# EAGLE design JW24A10L_revA (EAGLE 6.1)
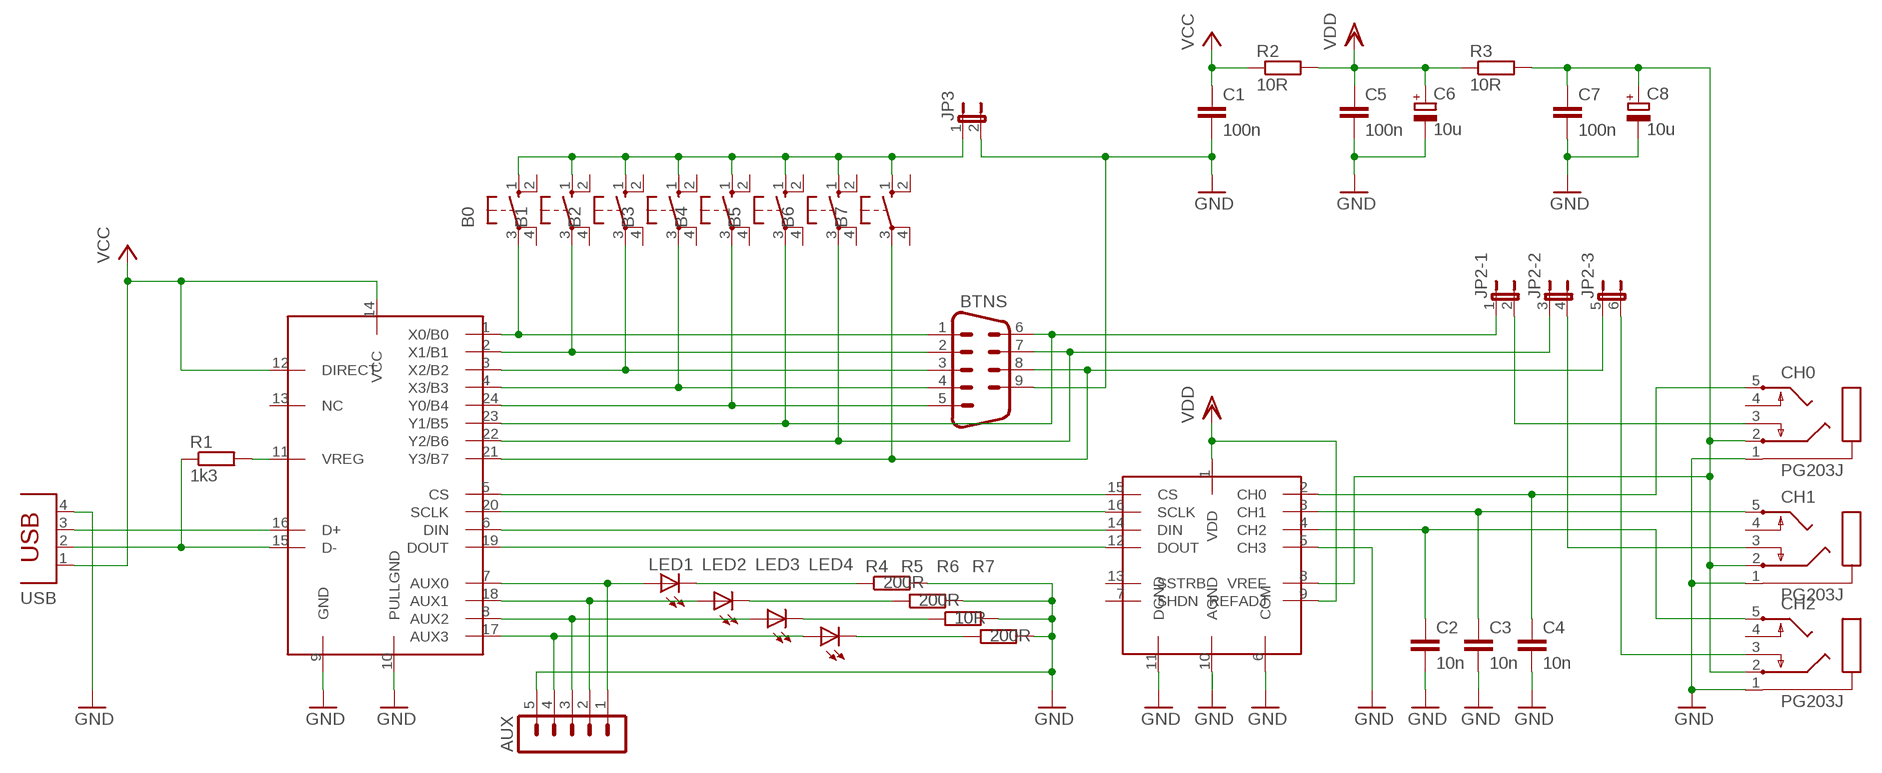
[diagram p0: schematic, sheet 1]

## Parts
AUX  MA05-1  [MA05-1]
B0  10-XX  [B3F-10XX]
B1  10-XX  [B3F-10XX]
B2  10-XX  [B3F-10XX]
B3  10-XX  [B3F-10XX]
B4  10-XX  [B3F-10XX]
B5  10-XX  [B3F-10XX]
B6  10-XX  [B3F-10XX]
B7  10-XX  [B3F-10XX]
BTNS  M09HP  [M09HP]
C1  100n  C-EU025-025X050  [C025-025X050]
C2  10n  C-EU025-025X050  [C025-025X050]
C3  10n  C-EU025-025X050  [C025-025X050]
C4  10n  C-EU025-025X050  [C025-025X050]
C5  100n  C-EU025-025X050  [C025-025X050]
C6  10u  CPOL-EUE2-5  [E2-5]
C7  100n  C-EU025-025X050  [C025-025X050]
C8  10u  CPOL-EUE2-5  [E2-5]
CH0  PG203J  [PG203J]
CH1  PG203J  [PG203J]
CH2  PG203J  [PG203J]
JP2  JP3QE  [JP3Q]
JP3  JP1E  [JP1]
LED1  LED3MM  [LED3MM]
LED2  LED3MM  [LED3MM]
LED3  LED3MM  [LED3MM]
LED4  LED3MM  [LED3MM]
R1  1k3  R-EU_0204/7  [0204/7]
R2  10R  R-EU_0204/7  [0204/7]
R3  10R  R-EU_0204/7  [0204/7]
R4  200R  R-EU_0204/7  [0204/7]
R5  200R  R-EU_0204/7  [0204/7]
R6  10R  R-EU_0204/7  [0204/7]
R7  200R  R-EU_0204/7  [0204/7]
U$1  MAX1249  [DIL16]
U$2  JW24A10L  [DIL24-3]
USB  PN61729  [PN61729]

## Nets
AUX0: AUX.1 LED1.A U$2.7(AUX0)
AUX1: AUX.2 LED2.A U$2.18(AUX1)
AUX2: AUX.3 LED3.A U$2.8(AUX2)
AUX3: AUX.4 LED4.A U$2.17(AUX3)
CH1: C4.1 CH0.5 U$1.2(CH0)
CH2: CH2.3 JP2.6
GND: AUX.5 BTNS.9 C1.2 C2.2 C3.2 C4.2 C5.2 C6.- C7.2 C8.- CH0.1 CH1.1 CH2.1 JP3.2 R4.2 R5.2 R6.2 R7.2 U$1.5(CH3) U$1.6(COM) U$1.10(AGND) U$1.11(DGND) U$2.9(GND) U$2.10(PULLGND) USB.4
N$1: U$1.15(CS) U$2.5(CS)
N$2: U$1.16(SCLK) U$2.20(SCLK)
N$3: U$1.14(DIN) U$2.6(DIN)
N$4: U$1.12(DOUT) U$2.19(DOUT)
N$5: U$2.16(D+) USB.3
N$6: R1.1 U$2.15(D-) USB.2
N$7: B0.3(P) BTNS.1 U$2.1(X0/B0)
N$9: R1.2 U$2.11(VREG)
N$10: C3.1 CH1.5 U$1.3(CH1)
N$11: C2.1 CH2.5 U$1.4(CH2)
N$12: B1.3(P) BTNS.2 U$2.2(X1/B1)
N$13: B2.3(P) BTNS.3 U$2.3(X2/B2)
N$14: B3.3(P) BTNS.4 U$2.4(X3/B3)
N$15: B4.3(P) BTNS.5 U$2.24(Y0/B4)
N$16: B5.3(P) BTNS.6 JP2.1 U$2.23(Y1/B5)
N$17: B6.3(P) BTNS.7 JP2.3 U$2.22(Y2/B6)
N$18: B7.3(P) BTNS.8 JP2.5 U$2.21(Y3/B7)
N$21: CH1.3 JP2.4
N$22: CH0.3 JP2.2
N$24: C7.1 C8.+ CH0.2 CH1.2 CH2.2 R3.2 U$1.8(VREF)
N$25: LED1.K(C) R4.1
N$26: LED2.K(C) R5.1
N$27: LED3.K(C) R6.1
N$28: LED4.K(C) R7.1
N$30: B0.1(S) B1.1(S) B2.1(S) B3.1(S) B4.1(S) B5.1(S) B6.1(S) B7.1(S) JP3.1
VCC: C1.1 R2.1 U$2.12(DIRECT) U$2.14(VCC) USB.1
VDD: C5.1 C6.+ R2.2 R3.1 U$1.1(VDD) U$1.9(REFADJ)
Unconnected: B0.2(S1) B0.4(P1) B1.2(S1) B1.4(P1) B2.2(S1) B2.4(P1) B3.2(S1) B3.4(P1) B4.2(S1) B4.4(P1) B5.2(S1) B5.4(P1) B6.2(S1) B6.4(P1) B7.2(S1) B7.4(P1) CH0.4 CH1.4 CH2.4 U$1.7(SHDN) U$1.13(SSTRB) U$2.13(NC)

## Library data of the parts
AUX = con-lstb:MA05-1: PIN HEADER; OC_FARNELL: unknown; OC_NEWARK: unknown
B0 B1-B7 = switch-omron:10-XX: OMRON SWITCH; MPN: B3F-1000; OC_FARNELL: 176432; OC_NEWARK: 36M3542
BTNS = con-subd:M09: SUB-D; OC_FARNELL: unknown; OC_NEWARK: unknown
C1-C5 C7 = rcl:C-EU: CAPACITOR, European symbol
C6 C8 = rcl:CPOL-EU: POLARIZED CAPACITOR, European symbol
CH0 CH1 CH2 = con-hirschmann:PG203J: MIC/HEADPHONE JACK KS-S stereo microphone/headphone jack PG203JN (Schukat); OC_FARNELL: unknown; OC_NEWARK: unknown
JP2 = jumper:JP3QE: JUMPER
JP3 = jumper:JP1E: JUMPER
LED1-LED4 = led:LED: LED OSRAM: - CHIPLED LG R971, LG N971, LY N971, LG Q971, LY Q971, LO R971, LY R971 LH N974, LH R974 LS Q976, LO Q976, LY Q976 LO Q996 - Hyper CHIPLED LW Q18S LB Q993, LB Q99A, LB R99A - SideLED LS A670, LO A670, LY A670, LG A670, LP A670 LB A673, LV A673, LT A673, LW A673 LH A674 LY A675 LS A676, LA A676, LO A676, LY A676, LW A676 LS A679, LY A679, LG A679 - Hyper Micro SIDELED® LS Y876, LA Y876, LO Y876, LY Y876 LT Y87S - SmartLED LW L88C, LW L88S LB L89C, LB L89S, LG L890 LS L89K, LO L89K, LY L89K LS L896, LA L896, LO L896, LY L896 - TOPLED LS T670, LO T670, LY T670, LG T670, LP T670 LSG T670, LSP T670, LSY T670, LOP T670, LYG T670 LG T671, LOG T671, LSG T671 LB T673, LV T673, LT T673, LW T673 LH T674 LS T676, LA T676, LO T676, LY T676, LB T676, LH T676, LSB T676, LW T676 LB T67C, LV T67C, LT T67C, LS T67K, LO T67K, LY T67K, LW E67C LS E67B, LA E67B, LO E67B, LY E67B, LB E67C, LV E67C, LT E67C LW T67C LS T679, LY T679, LG T679 LS T770, LO T770, LY T770, LG T770, LP T770 LB T773, LV T773, LT T773, LW T773 LH T774 LS E675, LA E675, LY E675, LS T675 LS T776, LA T776, LO T776, LY T776, LB T776 LHGB T686 LT T68C, LB T68C - Hyper Mini TOPLED® LB M676 - Mini TOPLED Santana® LG M470 LS M47K, LO M47K, LY M47K Source: http://www.osram.convergy.de LUXEON: - LUMILED® LXK2-PW12-R00, LXK2-PW12-S00, LXK2-PW14-U00, LXK2-PW14-V00 LXK2-PM12-R00, LXK2-PM12-S00, LXK2-PM14-U00 LXK2-PE12-Q00, LXK2-PE12-R00, LXK2-PE12-S00, LXK2-PE14-T00, LXK2-PE14-U00 LXK2-PB12-K00, LXK2-PB12-L00, LXK2-PB12-M00, LXK2-PB14-N00, LXK2-PB14-P00, LXK2-PB14-Q00 LXK2-PR12-L00, LXK2-PR12-M00, LXK2-PR14-Q00, LXK2-PR14-R00 LXK2-PD12-Q00, LXK2-PD12-R00, LXK2-PD12-S00 LXK2-PH12-R00, LXK2-PH12-S00 LXK2-PL12-P00, LXK2-PL12-Q00, LXK2-PL12-R00 Source: www.luxeon.com KINGBRIGHT: KA-3528ASYC Source: www.kingbright.com
R1-R7 = rcl:R-EU_: RESISTOR, European symbol
U$1 = eigene:MAX1249
U$2 = eigene:JW24A10L
USB = con-berg:PN61729: BERG USB connector; OC_FARNELL: unknown; OC_NEWARK: unknown

## Board
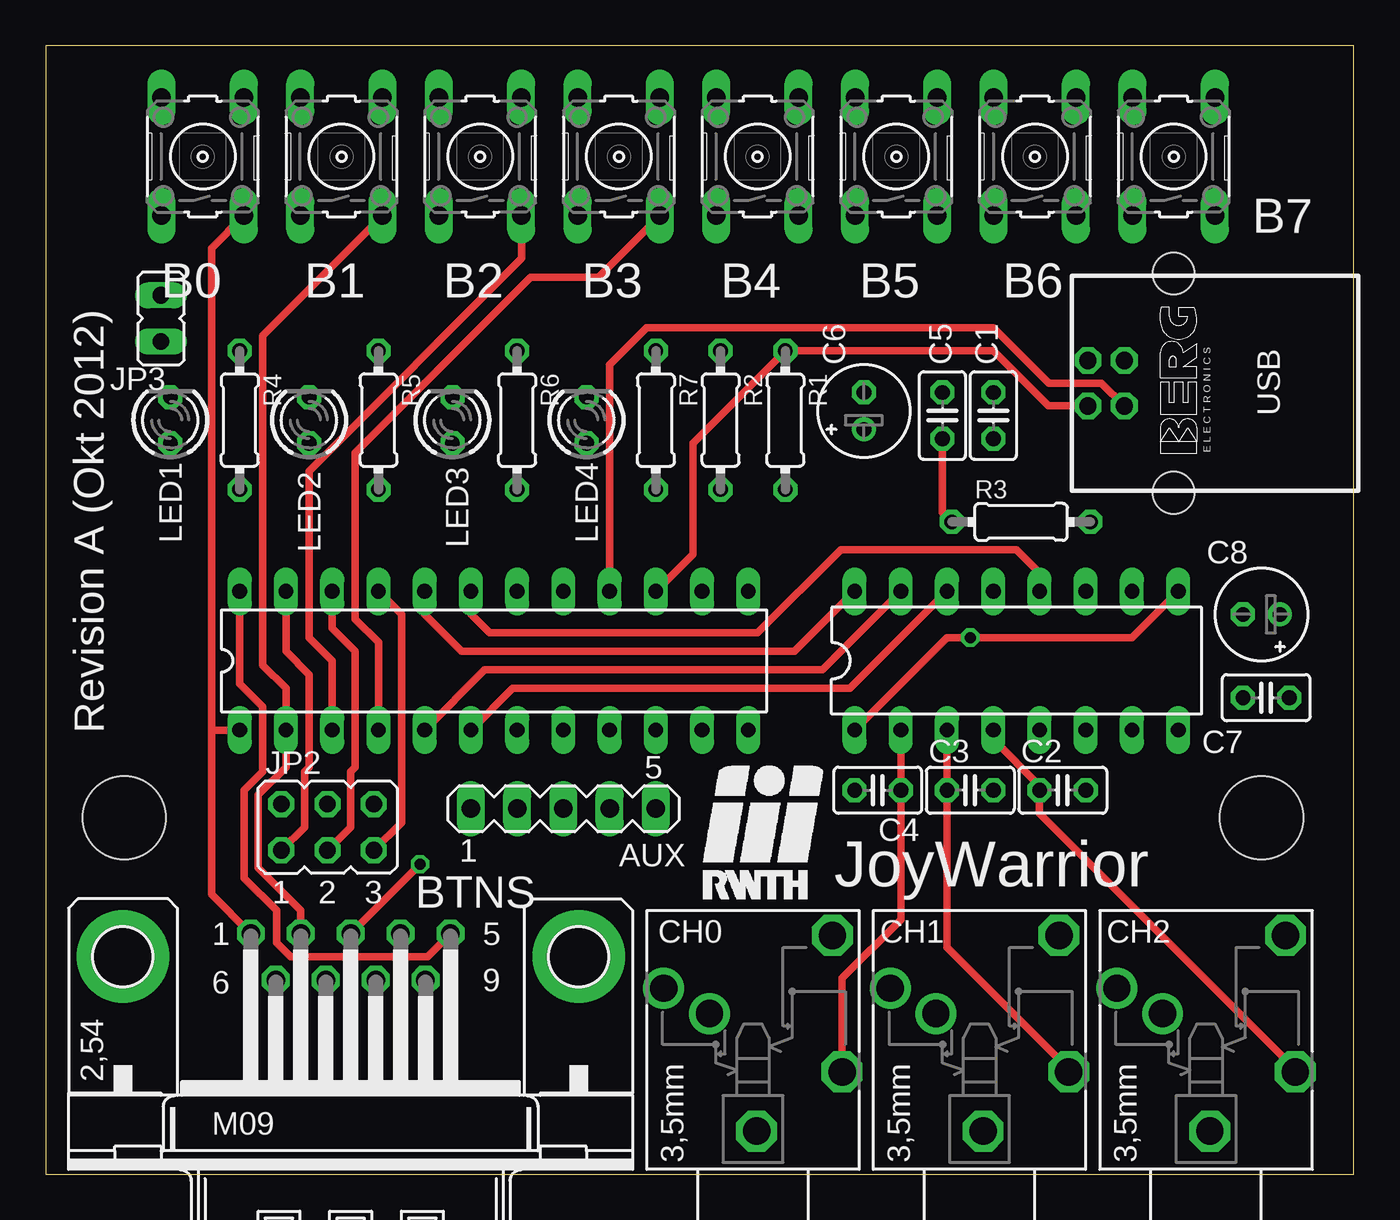
[diagram p1: board, top side]
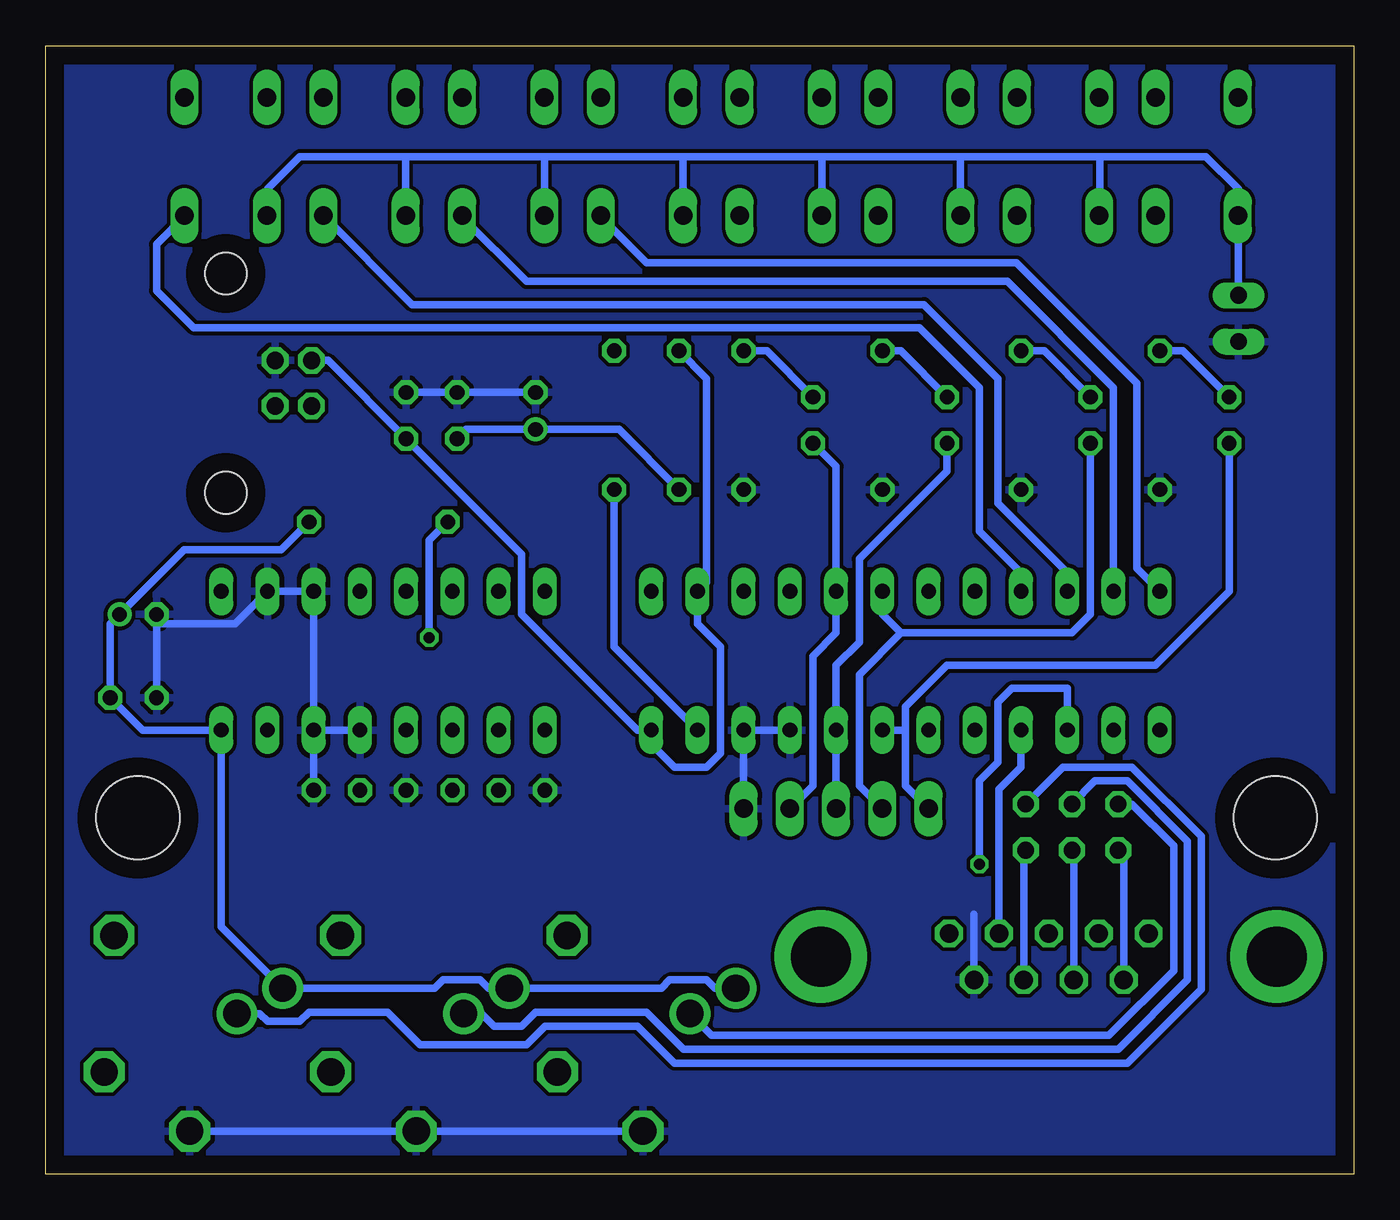
[diagram p2: board, bottom side, seen from below]

Size 71.88 x 61.98 mm. Coordinates in mm from the lower left corner, seen from the top.
Outline: 0,0 71.88,0 71.88,61.98 0,61.98 0,0
Copper layers (1*16): Top 0.035mm / dielectric 1.5mm / Bottom 0.035mm
Design rules: minimum track width 10mil, minimum drill 24mil, track to track 8mil, track to pad 8mil, pad to pad 8mil, via to via 8mil, smd to smd 8mil, copper to edge 40mil, drill to drill 8mil, minimum pad ring 10mil, minimum via ring 8mil, stop-mask expansion 4mil, vias tented up to drill 0mil, thermal gap 10mil
Holes 4.57 mm at 4.32,19.56 66.8,19.56

### Footprints (pad centres in the part's own frame; a part is rotated, then mirrored left to right if it is on the bottom)
MA05-1 = drill 1.016 long: 1 -5.08,0; 2 -2.54,0; 3 0,0; 4 2.54,0; 5 5.08,0
B3F-10XX = drill 1.016 long: 1 -3.251,2.261; 2 3.251,2.261; 3 -3.251,-2.261; 4 3.251,-2.261
M09HP = drill 1.016 octagon: 1 -5.486,1.27; 2 -2.743,1.27; 3 0,1.27; 4 2.743,1.27; 5 5.486,1.27; 6 -4.115,-1.27; 7 -1.372,-1.27; 8 1.372,-1.27; 9 4.115,-1.27 | drill 3.302 pad 5.08: G1 -12.522,0; G2 12.522,0
C025-025X050 = drill 0.813 octagon: 1 -1.27,0; 2 1.27,0
E2-5 = drill 0.813 pad 1.27: + -1.016,0 | drill 0.813 pad 1.27 octagon: - 1.016,0
PG203J = drill 1.499 octagon: 1 -5.004,-0.203; 4 5.74,-4.369; 5 -1.753,-4.902 | drill 1.499: 2 2.845,4.902; 3 1.448,2.388
JP3Q = drill 0.914 octagon: 1 -2.54,-1.27; 2 -2.54,1.27; 3 0,-1.27; 4 0,1.27; 5 2.54,-1.27; 6 2.54,1.27
JP1 = drill 0.914 long: 1 0,-1.27; 2 0,1.27
LED3MM = drill 0.813 octagon: A -1.27,0; K 1.27,0
0204/7 = drill 0.813 octagon: 1 -3.81,0; 2 3.81,0
DIL16 = drill 0.813 long: 1 -8.89,-3.81; 2 -6.35,-3.81; 3 -3.81,-3.81; 4 -1.27,-3.81; 5 1.27,-3.81; 6 3.81,-3.81; 7 6.35,-3.81; 8 8.89,-3.81; 9 8.89,3.81; 10 6.35,3.81; 11 3.81,3.81; 12 1.27,3.81; 13 -1.27,3.81; 14 -3.81,3.81; 15 -6.35,3.81; 16 -8.89,3.81
DIL24-3 = drill 0.813 long: 1 -13.97,-3.81; 2 -11.43,-3.81; 3 -8.89,-3.81; 4 -6.35,-3.81; 5 -3.81,-3.81; 6 -1.27,-3.81; 7 1.27,-3.81; 8 3.81,-3.81; 9 6.35,-3.81; 10 8.89,-3.81; 11 11.43,-3.81; 12 13.97,-3.81; 13 13.97,3.81; 14 11.43,3.81; 15 8.89,3.81; 16 6.35,3.81; 17 3.81,3.81; 18 1.27,3.81; 19 -1.27,3.81; 20 -3.81,3.81; 21 -6.35,3.81; 22 -8.89,3.81; 23 -11.43,3.81; 24 -13.97,3.81
PN61729 = drill 0.95 octagon: 1 1.25,4.71; 2 -1.25,4.71; 3 -1.25,2.71; 4 1.25,2.71 | hole 2.3: -6.02,0; 6.02,0

### Placement (x,y rotation side)
AUX  28.45,20.07 0 top
B0  8.64,55.88 90 top
B1  16.26,55.88 90 top
B2  23.88,55.88 90 top
B3  31.5,55.88 90 top
B4  39.12,55.88 90 top
B5  46.74,55.88 90 top
B6  54.36,55.88 90 top
B7  61.98,55.88 90 top
BTNS  16.76,11.94 0 top
C1  52.07,41.66 90 top
C2  55.88,21.08 0 top
C3  50.8,21.08 0 top
C4  45.72,21.08 180 top
C5  49.28,41.66 90 top
C6  44.96,41.91 90 top
C7  67.06,26.16 180 top
C8  66.8,30.73 180 top
CH0  38.86,7.37 90 top
CH1  51.31,7.37 90 top
CH2  63.75,7.37 90 top
JP2  15.49,19.05 0 top
JP3  6.35,46.99 180 top
LED1  6.86,41.4 90 top
LED2  14.48,41.4 90 top
LED3  22.35,41.4 90 top
LED4  29.72,41.4 90 top
R1  40.64,41.4 270 top
R2  37.08,41.4 270 top
R3  53.59,35.81 0 top
R4  10.67,41.4 270 top
R5  18.29,41.4 270 top
R6  25.91,41.4 270 top
R7  33.53,41.4 270 top
U$1  53.34,28.19 0 top
U$2  24.64,28.19 0 top
USB  61.98,43.43 90 top

### Tracks (layer width: path | path; a pad name or v marks a point on that pad's centre or on a via)
AUX0
  Bottom 0.406: LED1.A 6.86,32 10.92,27.94 22.35,27.94 24.64,25.65 24.64,24.38 | 24.64,24.38 24.64,21.34 AUX.1 | U$2.7 24.64,24.38
AUX1
  Bottom 0.406: LED2.A 14.48,30.73 15.49,29.72 24.89,29.72 | 24.89,29.72 25.91,30.73 U$2.18 | 24.89,29.72 27.18,27.43 27.18,21.34 AUX.2
AUX2
  Bottom 0.406: LED3.A 22.35,38.61 27.18,33.78 27.18,29.21 28.45,27.94 U$2.8 AUX.3
AUX3
  Bottom 0.406: LED4.A 28.45,38.86 U$2.17 28.45,29.72 29.72,28.45 29.72,21.34 AUX.4
CH1
  Top 0.406: U$1.2 C4.1 46.99,13.97 43.76,10.74 CH0.5
CH2
  Bottom 0.406: JP2.6 16,22.35 12.19,22.35 8.38,18.54 8.38,10.16 12.45,6.1 37.34,6.1 39.37,8.13 44.45,8.13 45.47,7.11 51.31,7.11 53.09,8.89 57.4,8.89 57.91,8.38 59.69,8.38 60.12,8.81 CH2.3
GND
  Bottom 0.406: C7.2 65.79,30.23 | 65.79,30.23 C8.- | U$1.6 U$1.11 U$1.10 61.47,30.23 65.79,30.23 | U$1.6 U$1.5 | CH0.1 CH1.1 CH2.1 | U$2.9 U$2.10 AUX.5 | BTNS.9 20.88,14.28 | C6.- C5.2 C1.2 | C2.2 U$1.6
  pour Bottom: -0.05,-0.03 71.88,0 71.88,61.98 0,61.98
N$1
  Top 0.406: U$1.15 42.67,27.69 24.13,27.69 U$2.5
N$2
  Top 0.406: U$1.16 41.15,28.7 22.86,28.7 20.83,30.73 U$2.20
N$3
  Top 0.406: U$1.14 44.2,26.67 25.65,26.67 U$2.6
N$4
  Top 0.406: U$1.12 54.61,33.02 53.34,34.29 43.69,34.29 39.12,29.72 24.38,29.72 23.37,30.73 U$2.19
N$5
  Top 0.406: U$2.16 30.99,44.45 33.02,46.48 52.07,46.48 55.12,43.43 58.02,43.43 USB.3
N$6
  Top 0.406: U$2.15 35.56,34.04 35.56,40.13 R1.1 52.07,45.21 55.1,42.18 USB.2
N$7
  Top 0.406: 9.12,24.38 9.12,15.37 BTNS.1 | U$2.1 9.12,24.38 | B0.3 9.12,50.85 9.12,24.38
N$9
  Bottom 0.406: R1.2 40.64,28.96 U$2.11
N$10
  Top 0.406: U$1.3 C3.1 49.53,12.45 56.21,5.77 CH1.5
N$11
  Top 0.406: U$1.4 52.07,23.88 54.61,21.34 C2.1 54.61,19.81 68.66,5.77 CH2.5
N$12
  Top 0.406: B1.3 11.94,46.05 11.94,27.94 13.21,26.67 U$2.2 13.21,22.35 11.68,20.83 11.68,16.82 14.02,14.48 BTNS.2
N$13  (via drill 0.6)
  Top 0.406: U$2.3 15.75,28.19 14.48,29.46 14.48,38.61 26.16,50.29 26.16,52.6 B2.3 | v20.57,17.02 BTNS.3
  Bottom 0.406: U$2.3 15.75,26.67 18.8,26.67 19.56,25.91 19.56,22.61 20.57,21.59 v20.57,17.02
N$14
  Top 0.406: U$2.4 18.29,29.21 17.02,30.48 17.02,39.62 26.64,49.25 30.38,49.25 B3.3
  Bottom 0.406: U$2.4 18.29,22.35 19.51,21.13 BTNS.4
N$15
  Top 0.406: U$2.24 10.67,26.92 11.94,25.65 11.94,22.1 10.92,21.08 10.92,16.26 12.7,14.48 12.7,12.7 13.46,11.94 20.98,11.94 BTNS.5
  Bottom 0.406: B4.3 41.38,52.55 38.86,50.04 18.54,50.04 11.94,43.43 11.94,33.27 U$2.24
N$16
  Top 0.406: U$2.23 13.21,28.7 14.48,27.43 14.48,22.35 14.22,22.1 14.22,19.05 JP2.1
  Bottom 0.406: B5.3 49,52.55 45.47,49.02 19.05,49.02 13.21,43.18 U$2.23 | JP2.1 12.65,17.48 BTNS.6
N$17
  Top 0.406: U$2.22 15.75,29.97 17.02,28.7 17.02,22.35 16.76,22.1 16.76,19.05 JP2.3
  Bottom 0.406: B6.3 51.74,47.75 23.62,47.75 19.56,43.69 19.56,36.83 15.75,33.02 U$2.22 | JP2.3 15.39,17.68 BTNS.7
N$18
  Top 0.406: JP2.5 19.56,19.3 19.56,30.73 U$2.21
  Bottom 0.406: U$2.21 18.29,33.02 20.57,35.31 20.57,43.18 23.88,46.48 63.75,46.48 65.79,48.51 65.79,51.05 64.24,52.6 B7.3 | BTNS.8 18.14,17.68 JP2.5
N$21
  Bottom 0.406: JP2.4 14.22,21.59 12.45,21.59 9.14,18.29 9.14,10.67 12.95,6.86 36.83,6.86 38.86,8.89 44.96,8.89 45.72,8.13 47.24,8.13 47.93,8.81 CH1.3
N$22
  Bottom 0.406: CH0.3 36.5,8.81 35.31,7.62 13.46,7.62 9.91,11.18 9.91,18.03 12.19,20.32 JP2.2
N$24
  Bottom 0.406: CH0.2 35.1,10.21 35.56,10.67 37.59,10.67 38.05,10.21 CH1.2 47.55,10.21 48.01,10.67 50.04,10.67 50.49,10.21 CH2.2 62.23,13.59 U$1.8 66.55,24.38 C7.1 68.33,30.23 C8.+ 64.26,34.29 58.93,34.29 R3.2
N$25
  Bottom 0.406: LED1.K 9.4,45.21 R4.1
N$26
  Bottom 0.406: LED2.K 17.02,45.21 R5.1
N$27
  Bottom 0.406: LED3.K 24.89,45.21 R6.1
N$28
  Bottom 0.406: LED4.K 32.26,45.21 R7.1
N$30
  Bottom 0.406: 13.97,55.88 21.59,55.88 | 21.59,55.88 29.21,55.88 | 29.21,55.88 36.83,55.88 | 36.83,55.88 44.45,55.88 | 44.45,55.88 52.07,55.88 | 52.07,55.88 57.91,55.88 59.69,54.1 59.69,52.65 B7.1 | B6.1 52.09,55.85 52.07,55.88 | 13.97,55.88 8.13,55.88 6.35,54.1 6.35,52.65 B0.1 6.35,52.6 JP3.1 | 13.97,55.88 13.97,52.65 B1.1 | B2.1 21.61,55.85 21.59,55.88 | B3.1 29.23,55.85 29.21,55.88 | B4.1 36.85,55.85 36.83,55.88 | B5.1 44.48,55.85 44.45,55.88
VCC
  Bottom 0.406: R2.1 35.56,43.69 35.56,32.51 U$2.14 36.07,30.23 34.8,28.96 34.8,23.11 35.56,22.35 37.34,22.35 38.61,23.62 U$2.12 39.37,24.38 45.72,30.73 45.72,34.04 C1.1 56.37,44.68 USB.1
VDD  (via drill 0.6)
  Top 0.406: U$1.1 49.53,29.46 v50.8,29.46 59.69,29.46 U$1.9 | C5.1 49.28,36.32 R3.1
  Bottom 0.406: R2.2 40.39,40.89 C6.+ 48.77,40.89 C5.1 | R3.1 50.8,34.8 v50.8,29.46

### Text on the board
tPlace: Revision A (Okt 2012) | JoyWarrior